# Altium schematic sheet 44TSOPBreakout.SchDoc
size A
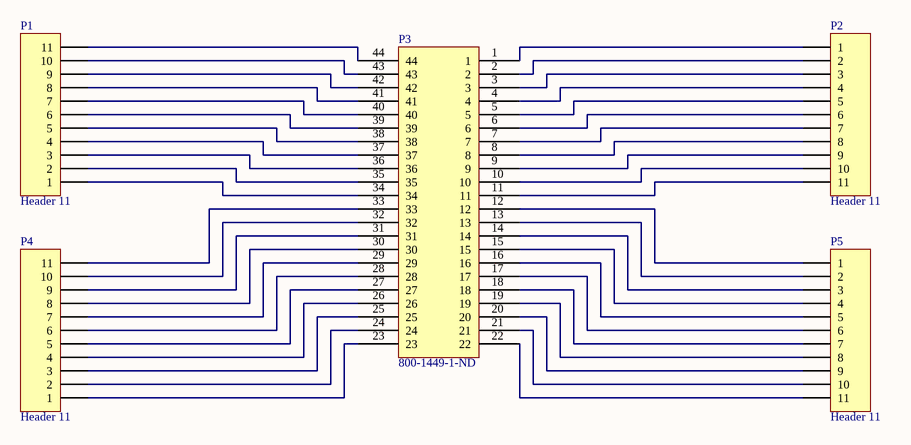
[diagram p0: 44TSOPBreakout.SchDoc]

## Parts
P1  Header 11  [HDR1X11]
P2  Header 11  [HDR1X11]
P3  Supplier Part Number 1: 800-1449-1-ND  [TSOP80P1180X119-44N]  (hidden comment: 71V016SA10PHG8)
P4  Header 11  [HDR1X11]
P5  Header 11  [HDR1X11]

## Nets
NetP1_1: P1.1 P3.34
NetP1_2: P1.2 P3.35
NetP1_3: P1.3 P3.36
NetP1_4: P1.4 P3.37
NetP1_5: P1.5 P3.38
NetP1_6: P1.6 P3.39
NetP1_7: P1.7 P3.40
NetP1_8: P1.8 P3.41
NetP1_9: P1.9 P3.42
NetP1_10: P1.10 P3.43
NetP1_11: P1.11 P3.44
NetP2_1: P2.1 P3.1
NetP2_2: P2.2 P3.2
NetP2_3: P2.3 P3.3
NetP2_4: P2.4 P3.4
NetP2_5: P2.5 P3.5
NetP2_6: P2.6 P3.6
NetP2_7: P2.7 P3.7
NetP2_8: P2.8 P3.8
NetP2_9: P2.9 P3.9
NetP2_10: P2.10 P3.10
NetP2_11: P2.11 P3.11
NetP3_12: P3.12 P5.1
NetP3_13: P3.13 P5.2
NetP3_14: P3.14 P5.3
NetP3_15: P3.15 P5.4
NetP3_16: P3.16 P5.5
NetP3_17: P3.17 P5.6
NetP3_18: P3.18 P5.7
NetP3_19: P3.19 P5.8
NetP3_20: P3.20 P5.9
NetP3_21: P3.21 P5.10
NetP3_22: P3.22 P5.11
NetP3_23: P3.23 P4.1
NetP3_24: P3.24 P4.2
NetP3_25: P3.25 P4.3
NetP3_26: P3.26 P4.4
NetP3_27: P3.27 P4.5
NetP3_28: P3.28 P4.6
NetP3_29: P3.29 P4.7
NetP3_30: P3.30 P4.8
NetP3_31: P3.31 P4.9
NetP3_32: P3.32 P4.10
NetP3_33: P3.33 P4.11

## Library data of the parts
P1 P2 P4 P5 = Header 11: Header, 11-Pin; LatestRevisionDate: 17-Jul-2002; LatestRevisionNote: Re-released for DXP Platform.; Publisher: Altium Limited
P3 = 71V016SA10PHG8: IC SRAM 1MBIT 10NS 44TSOP; Manufacturer: IDT, Integrated Device Technology Inc; Format - Memory: RAM; Memory Type: SRAM - Asynchronous; Memory Size: 1M (64K x 16); Interface: Parallel; Voltage - Supply: 3.15 V ~ 3.6 V; Supplier 1: Digi-Key; Manufacturer Part Number: 71V016SA10PHG8; RoHS: RoHS Compliant; Category: Integrated Circuits (ICs); Stock 1: 2502; Pricing 1: 1=2.71, 25=2.1932, 100=1.972, 250=1.751, 500=1.53 (USD); Packaging: Cut Tape (CT); Speed: 10ns; Operating Temperature: 0°C ~ 70°C; Package / Case: 44-TSOP (0.400", 10.16mm Width); Supplier Device Package: 44-TSOP II; ComponentLink1URL: http://www.idt.com/document/71v016sa-datasheet; ComponentLink1Description: http://www.idt.com/document/71v016sa-datasheet